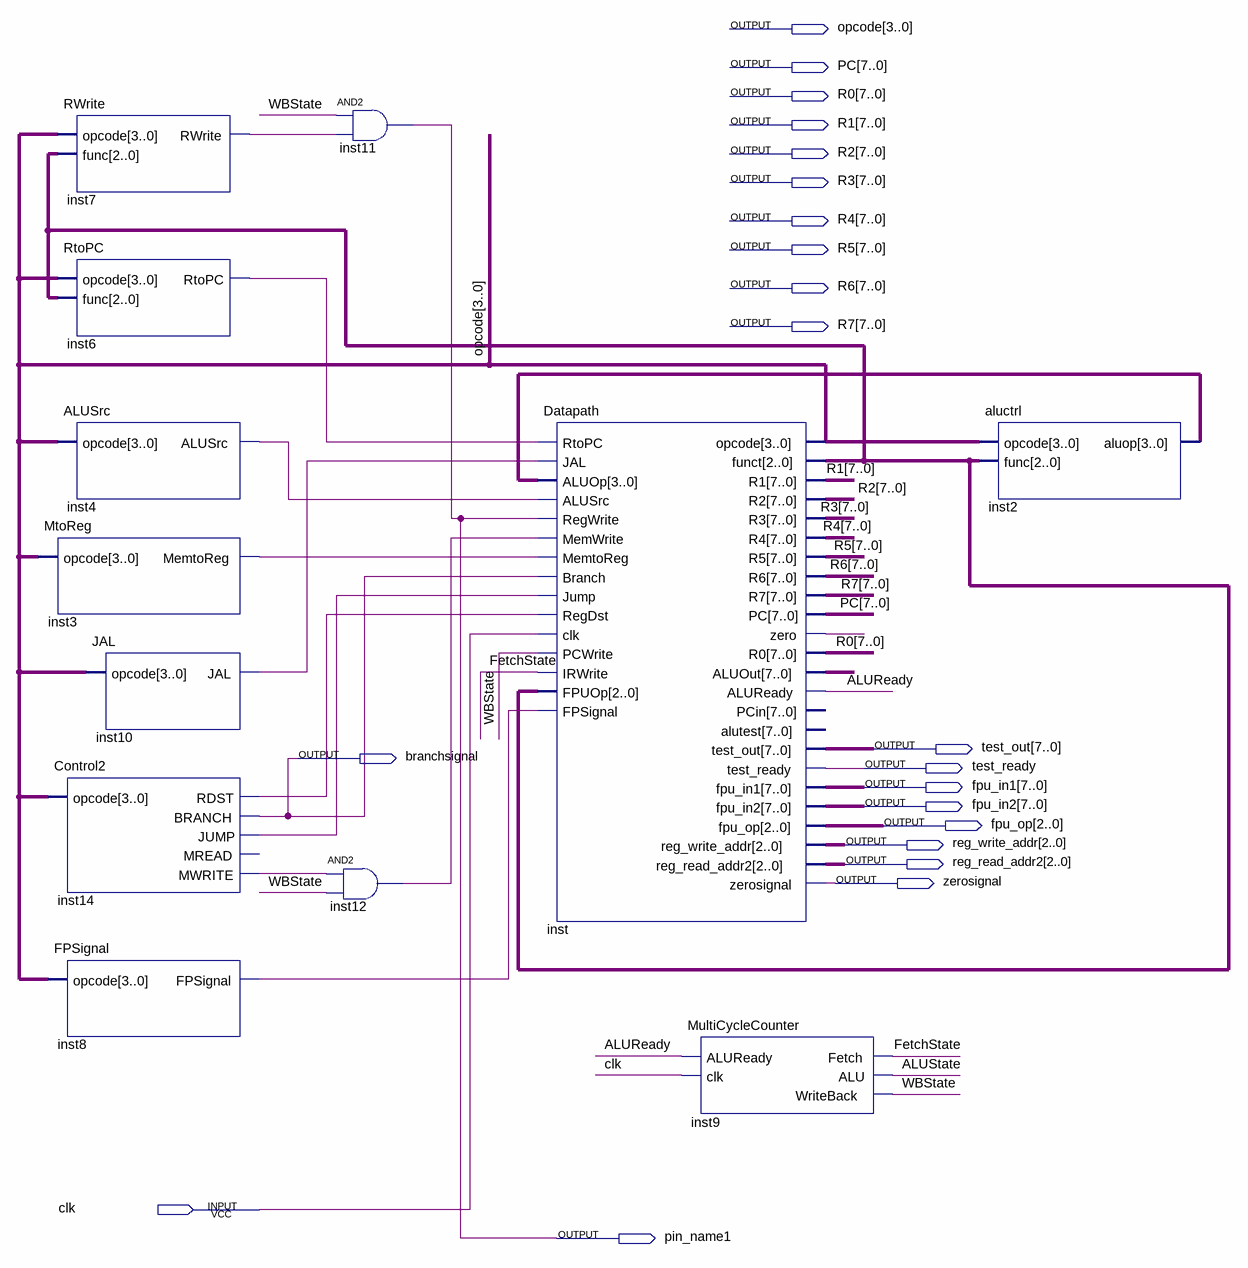
[diagram p0: schematic sheet]
// Quartus schematic CPU.bdf as structural Verilog: 12 symbols, 21 pins
module CPU (
  input  clk,
  output [3:0] opcode,
  output [7:0] PC,
  output [7:0] R0,
  output [7:0] R1,
  output [7:0] R2,
  output [7:0] R3,
  output [7:0] R4,
  output [7:0] R5,
  output [7:0] R6,
  output [7:0] R7,
  output [7:0] test_out,
  output branchsignal,
  output test_ready,
  output [7:0] fpu_in1,
  output [7:0] fpu_in2,
  output [2:0] fpu_op,
  output [2:0] reg_write_addr,
  output [2:0] reg_read_addr2,
  output zerosignal,
  output pin_name1
);

  wire ALUReady, ALUState, FetchState, inst3_memtoreg, inst4_alusrc, inst6_rtopc, inst7_rwrite,
       inst8_fpsignal, inst10_jal, inst12_out, inst14_jump, inst14_mwrite, inst14_rdst, inst_zero, WBState;
  wire [2:0] inst_funct;
  wire [3:0] inst2_aluop;
  wire [7:0] inst_aluout;

  RWrite inst7 (.opcode(opcode), .func(inst_funct), .RWrite(inst7_rwrite));
  RtoPC inst6 (.opcode(opcode), .func(inst_funct), .RtoPC(inst6_rtopc));
  ALUSrc inst4 (.opcode(opcode), .ALUSrc(inst4_alusrc));
  MtoReg inst3 (.opcode(opcode), .MemtoReg(inst3_memtoreg));
  JAL inst10 (.opcode(opcode), .JAL(inst10_jal));
  Control2 inst14 (
    .opcode(opcode), .RDST(inst14_rdst), .BRANCH(branchsignal), .JUMP(inst14_jump), .MWRITE(inst14_mwrite));  // open: MREAD
  FPSignal inst8 (.opcode(opcode), .FPSignal(inst8_fpsignal));
  and inst12 (inst12_out, inst14_mwrite, WBState);
  and inst11 (pin_name1, WBState, inst7_rwrite);
  Datapath inst (
    .RtoPC(inst6_rtopc), .JAL(inst10_jal), .ALUOp(inst2_aluop), .ALUSrc(inst4_alusrc), .RegWrite(pin_name1),
    .MemWrite(inst12_out), .MemtoReg(inst3_memtoreg), .Branch(branchsignal), .Jump(inst14_jump),
    .RegDst(inst14_rdst), .clk(clk), .PCWrite(WBState), .IRWrite(FetchState), .FPUOp(inst_funct),
    .FPSignal(inst8_fpsignal), .opcode(opcode), .funct(inst_funct), .R1(R1), .R2(R2), .R3(R3), .R4(R4),
    .R5(R5), .R6(R6), .R7(R7), .PC(PC), .zero(inst_zero), .R0(R0), .ALUOut(inst_aluout), .ALUReady(ALUReady),
    .test_out(test_out), .test_ready(test_ready), .fpu_in1(fpu_in1), .fpu_in2(fpu_in2), .fpu_op(fpu_op),
    .reg_write_addr(reg_write_addr), .reg_read_addr2(reg_read_addr2), .zerosignal(zerosignal));  // open: PCin, alutest
  MultiCycleCounter inst9 (.ALUReady(ALUReady), .clk(clk), .Fetch(FetchState), .ALU(ALUState), .WriteBack(WBState));
  aluctrl inst2 (.opcode(opcode), .func(inst_funct), .aluop(inst2_aluop));
endmodule
